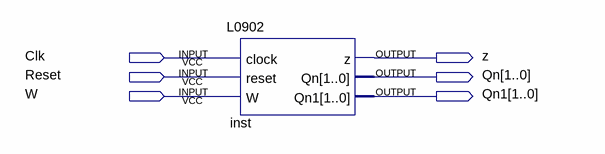
[diagram p0: schematic sheet]
// Quartus schematic Block1.bdf as structural Verilog: 1 symbols, 6 pins
module Block1 (
  input  Clk,
  input  Reset,
  input  W,
  output z,
  output [1:0] Qn,
  output [1:0] Qn1
);

  L0902 inst (.clock(Clk), .reset(Reset), .W(W), .z(z), .Qn(Qn), .Qn1(Qn1));
endmodule
